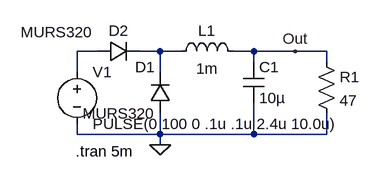
[diagram p0: schematic FwdTst.asc]
FwdTst.asc, the LTspice schematic file:
Version 4
SHEET 1 880 680
WIRE -128 192 -128 160
WIRE -128 288 -128 272
WIRE -96 160 -128 160
WIRE 0 160 -32 160
WIRE 0 192 0 160
WIRE 0 288 -128 288
WIRE 0 288 0 256
WIRE 0 304 0 288
WIRE 32 160 0 160
WIRE 144 160 112 160
WIRE 144 176 144 160
WIRE 144 288 0 288
WIRE 144 288 144 240
WIRE 208 160 144 160
WIRE 256 160 208 160
WIRE 256 176 256 160
WIRE 256 288 144 288
WIRE 256 288 256 256
FLAG 0 304 0
FLAG 208 160 Out
SYMBOL ind 16 176 R270
WINDOW 0 32 56 VTop 0
WINDOW 3 5 56 VBottom 0
SYMATTR InstName L1
SYMATTR Value 1m
SYMBOL diode 16 256 R180
WINDOW 0 24 72 Left 0
WINDOW 3 24 0 Left 0
SYMATTR InstName D1
SYMATTR Value MURS320
SYMBOL cap 128 176 R0
SYMATTR InstName C1
SYMATTR Value 10µ
SYMBOL res 240 160 R0
SYMATTR InstName R1
SYMATTR Value 47
SYMBOL voltage -128 176 R0
WINDOW 123 0 0 Left 0
WINDOW 39 0 0 Left 0
SYMATTR InstName V1
SYMATTR Value PULSE(0 100 0 .1u .1u 2.4u 10.0u)
SYMBOL diode -96 176 R270
WINDOW 0 32 32 VTop 0
WINDOW 3 61 -63 VBottom 0
SYMATTR InstName D2
SYMATTR Value MURS320
TEXT -130 314 Left 0 !.tran 5m

The netlist it stands for:
* FwdTst.asc
L1 N002 Out 1m
D1 0 N002 MURS320
C1 Out 0 10µ
R1 Out 0 47
V1 N001 0 PULSE(0 100 0 .1u .1u 2.4u 10.0u)
D2 N001 N002 MURS320
.model D D
.lib standard.dio
.tran 5m
.backanno
.end